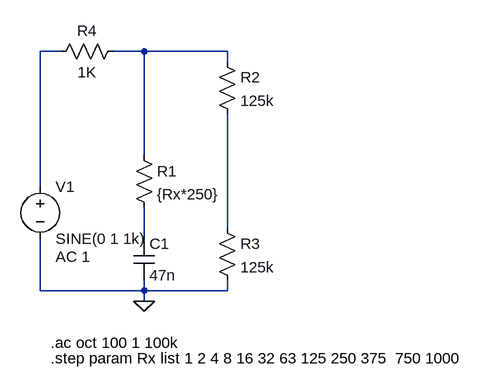
[diagram p0: schematic TONE.asc]
TONE.asc, the LTspice schematic file:
Version 4
SHEET 1 880 680
WIRE 80 -64 48 -64
WIRE 208 -64 160 -64
WIRE 336 -64 208 -64
WIRE 336 -48 336 -64
WIRE 208 96 208 -64
WIRE 48 144 48 -64
WIRE 336 208 336 32
WIRE 208 224 208 176
WIRE 48 304 48 224
WIRE 208 304 208 288
WIRE 208 304 48 304
WIRE 336 304 336 288
WIRE 336 304 208 304
WIRE 208 320 208 304
FLAG 208 320 0
SYMBOL res 192 80 R0
SYMATTR InstName R1
SYMATTR Value {Rx*250}
SYMBOL cap 192 224 R0
SYMATTR InstName C1
SYMATTR Value 47n
SYMBOL voltage 48 128 R0
WINDOW 123 24 124 Left 2
WINDOW 39 0 0 Left 2
SYMATTR Value2 AC 1
SYMATTR InstName V1
SYMATTR Value SINE(0 1 1k)
SYMBOL res 320 -64 R0
SYMATTR InstName R2
SYMATTR Value 125k
SYMBOL res 320 192 R0
SYMATTR InstName R3
SYMATTR Value 125k
SYMBOL res 176 -80 R90
WINDOW 0 0 56 VBottom 2
WINDOW 3 32 56 VTop 2
SYMATTR InstName R4
SYMATTR Value 1K
TEXT 64 408 Left 2 !.step param Rx list 1 2 4 8 16 32 63 125 250 375  750 1000
TEXT 64 384 Left 2 !.ac oct 100 1 100k

The netlist it stands for:
* TONE.asc
R1 N002 N004 {Rx*250}
C1 N004 0 47n
V1 N001 0 SINE(0 1 1k) AC 1
R2 N002 N003 125k
R3 N003 0 125k
R4 N002 N001 1K
.step param Rx list 1 2 4 8 16 32 63 125 250 375  750 1000
.ac oct 100 1 100k
.backanno
.end